# EAGLE schematic MasterMind_dll (EAGLE 7.1.0)
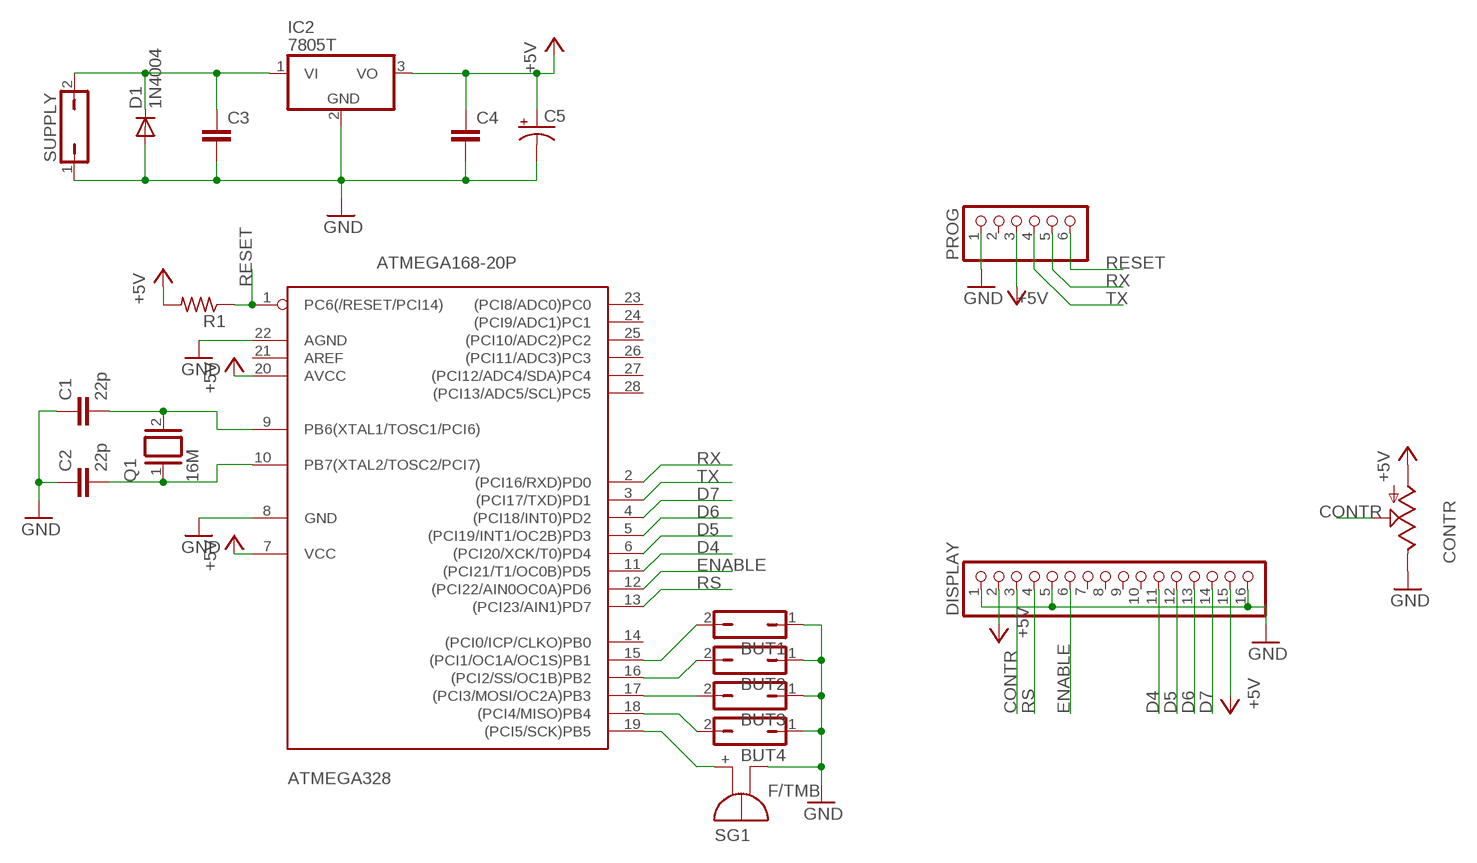
[diagram p0: schematic, sheet 1]

## Parts
ATMEGA328  ATMEGA168-20P  [DIL28-3]
BUT1  JP1Q  [JP1]
BUT2  JP1Q  [JP1]
BUT3  JP1Q  [JP1]
BUT4  JP1Q  [JP1]
C1  22p  C-EU025-024X044  [C025-024X044]
C2  22p  C-EU025-024X044  [C025-024X044]
C3  C-EU050-025X075  [C050-025X075]
C4  C-EU050-025X075  [C050-025X075]
C5  CPOL-USE2,5-6E  [E2,5-6E]
CONTR  TRIM_US-B64Y  [B64Y]
D1  1N4004  [DO41-10]
DISPLAY  PINHD-1X16  [1X16]
IC2  7805T  [TO220H]
PROG  PINHD-1X6/90  [1X06/90]
Q1  16M  XTAL/S  [QS]
R1  R-US_0204/7  [0204/7]
SG1  F/TMB  [F/TMB]
SUPPLY  JP1Q  [JP1]

## Nets
+5V: ATMEGA328.7(VCC) ATMEGA328.20(AVCC) C4.1 C5.+ CONTR.A DISPLAY.2 DISPLAY.15 IC2.3(VO) PROG.3 R1.2
CONTR: CONTR.S DISPLAY.3
D4: ATMEGA328.11((PCI21/T1/OC0B)PD5) DISPLAY.11
D5: ATMEGA328.6((PCI20/XCK/T0)PD4) DISPLAY.12
D6: ATMEGA328.5((PCI19/INT1/OC2B)PD3) DISPLAY.13
D7: ATMEGA328.4((PCI18/INT0)PD2) DISPLAY.14
ENABLE: ATMEGA328.12((PCI22/AIN0OC0A)PD6) DISPLAY.6
GND: ATMEGA328.8(GND) ATMEGA328.22(AGND) BUT1.1 BUT2.1 BUT3.1 BUT4.1 C1.1 C2.1 C3.2 C4.2 C5.- CONTR.E D1.A DISPLAY.1 DISPLAY.5 DISPLAY.16 IC2.2(GND) PROG.1 SG1.- SUPPLY.1
N$1: ATMEGA328.10(PB7(XTAL2/TOSC2/PCI7)) C2.2 Q1.1
N$2: ATMEGA328.9(PB6(XTAL1/TOSC1/PCI6)) C1.2 Q1.2
N$3: ATMEGA328.19((PCI5/SCK)PB5) SG1.+
N$4: ATMEGA328.18((PCI4/MISO)PB4) BUT4.2
N$5: ATMEGA328.17((PCI3/MOSI/OC2A)PB3) BUT3.2
N$6: ATMEGA328.16((PCI2/SS/OC1B)PB2) BUT2.2
N$7: ATMEGA328.15((PCI1/OC1A/OC1S)PB1) BUT1.2
N$10: C3.1 D1.C IC2.1(VI) SUPPLY.2
RESET: ATMEGA328.1(PC6(/RESET/PCI14)) PROG.6 R1.1
RS: ATMEGA328.13((PCI23/AIN1)PD7) DISPLAY.4
RX: ATMEGA328.2((PCI16/RXD)PD0) PROG.5
TX: ATMEGA328.3((PCI17/TXD)PD1) PROG.4
Unconnected: ATMEGA328.14((PCI0/ICP/CLKO)PB0) ATMEGA328.21(AREF) ATMEGA328.23((PCI8/ADC0)PC0) ATMEGA328.24((PCI9/ADC1)PC1) ATMEGA328.25((PCI10/ADC2)PC2) ATMEGA328.26((PCI11/ADC3)PC3) ATMEGA328.27((PCI12/ADC4/SDA)PC4) ATMEGA328.28((PCI13/ADC5/SCL)PC5) DISPLAY.7 DISPLAY.8 DISPLAY.9 DISPLAY.10 PROG.2

## Library data of the parts
ATMEGA328 = adafruit:ATMEGA168*P: MICROCONTROLLER 16 kBytes FLASH 1 kBytes SRAM 512 Bytes EEPROM USART 8-channel 10 bit ADC
BUT1-BUT4 SUPPLY = jumper:JP1Q: JUMPER
C1 C2 = resistor:C-EU: CAPACITOR, European symbol; SPICEPREFIX: C
C3 C4 = rcl:C-EU: CAPACITOR, European symbol
C5 = rcl:CPOL-US: POLARIZED CAPACITOR, American symbol
CONTR = pot:TRIM_US-: POTENTIOMETER
D1 = diode:1N4004: DIODE general purpose rectifier, 1 A
DISPLAY = pinhead:PINHD-1X16: PIN HEADER
IC2 = linear:78*: Positive VOLTAGE REGULATOR Source: http://cache.national.com/ds/LM/LM78L05.pdf http://www.fairchildsemi.com/ds/LM/LM7805.pdf
PROG = pinhead:PINHD-1X6: PIN HEADER
Q1 = special:XTAL/S: CRYSTAL
R1 = resistor:R-US_: RESISTOR, American symbol
SG1 = buzzer:F/TMB: BUZZER Source: Buerklin; OC_FARNELL: unknown; OC_NEWARK: unknown